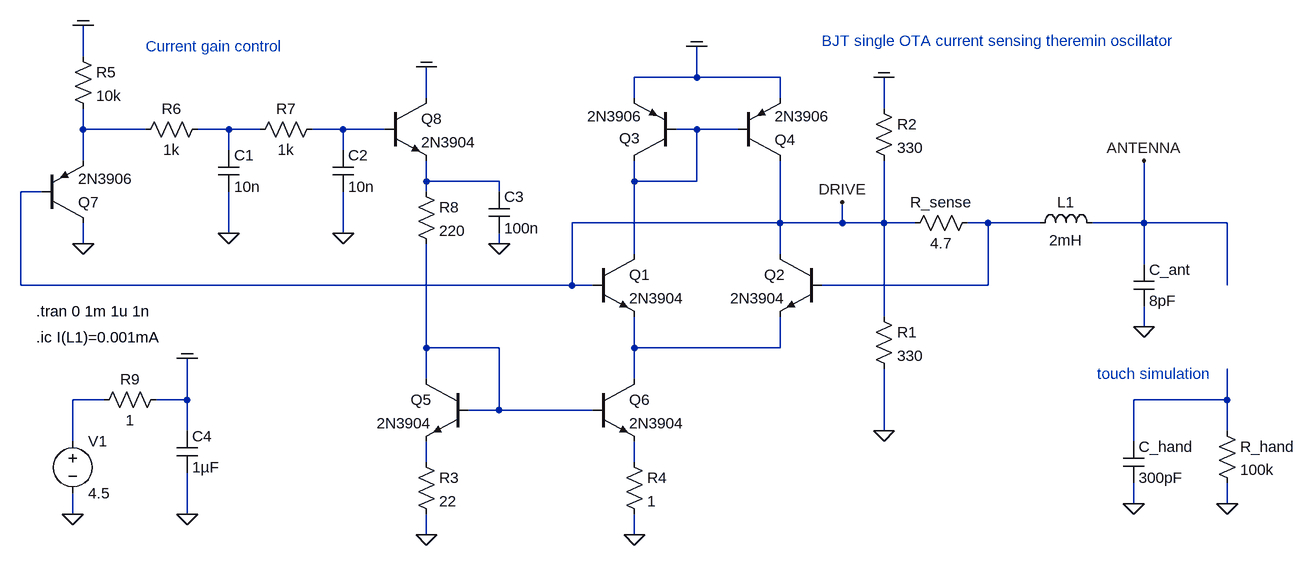
[diagram p0: schematic bjt_current_sensing_oscillator_ota_v4.asc]
bjt_current_sensing_oscillator_ota_v4.asc, the LTspice schematic file:
Version 4
SHEET 1 4500 2052
WIRE -32 0 -32 -48
WIRE 912 32 912 -16
WIRE 912 32 816 32
WIRE 1040 32 912 32
WIRE 496 64 496 16
WIRE 816 64 816 32
WIRE 1040 64 1040 32
WIRE 1200 80 1200 32
WIRE -32 112 -32 80
WIRE 64 112 -32 112
WIRE 192 112 144 112
WIRE 240 112 192 112
WIRE 368 112 320 112
WIRE 432 112 368 112
WIRE 912 112 880 112
WIRE 976 112 912 112
WIRE 192 144 192 112
WIRE 368 144 368 112
WIRE -32 160 -32 112
WIRE 496 192 496 160
WIRE 608 192 496 192
WIRE 816 192 816 160
WIRE 912 192 912 112
WIRE 912 192 816 192
WIRE -96 208 -128 208
WIRE 496 208 496 192
WIRE 608 208 608 192
WIRE 1040 256 1040 160
WIRE 1040 256 720 256
WIRE 1136 256 1136 224
WIRE 1136 256 1040 256
WIRE 1200 256 1200 160
WIRE 1200 256 1136 256
WIRE 1248 256 1200 256
WIRE 1360 256 1328 256
WIRE 1440 256 1360 256
WIRE 1600 256 1600 160
WIRE 1600 256 1520 256
WIRE 1728 256 1600 256
WIRE 192 272 192 208
WIRE 368 272 368 208
WIRE -32 288 -32 256
WIRE 608 288 608 272
WIRE 816 304 816 192
WIRE 1040 304 1040 256
WIRE 1600 320 1600 256
WIRE -128 352 -128 208
WIRE 720 352 720 256
WIRE 720 352 -128 352
WIRE 752 352 720 352
WIRE 1360 352 1360 256
WIRE 1360 352 1104 352
WIRE 1728 352 1728 256
WIRE 1200 400 1200 256
WIRE 1600 416 1600 384
WIRE 496 448 496 288
WIRE 608 448 496 448
WIRE 816 448 816 400
WIRE 1040 448 1040 400
WIRE 1040 448 816 448
WIRE 496 496 496 448
WIRE 816 496 816 448
WIRE 0 528 -48 528
WIRE 128 528 128 464
WIRE 128 528 80 528
WIRE 1728 528 1728 480
WIRE 1728 528 1584 528
WIRE 608 544 608 448
WIRE 608 544 560 544
WIRE 752 544 608 544
WIRE 128 576 128 528
WIRE 1200 576 1200 480
WIRE 1728 576 1728 528
WIRE -48 592 -48 528
WIRE 1584 592 1584 528
WIRE 496 624 496 592
WIRE 816 624 816 592
WIRE 1584 688 1584 656
WIRE 1728 688 1728 656
WIRE -48 704 -48 672
WIRE 128 704 128 640
WIRE 496 736 496 704
WIRE 816 736 816 704
FLAG 1600 416 0
FLAG 1600 160 ANTENNA
FLAG 1200 576 0
FLAG -48 704 0
FLAG 128 464 COM
FLAG 912 -16 COM
FLAG 192 272 0
FLAG 368 272 0
FLAG -32 -48 COM
FLAG -32 288 0
FLAG 496 16 COM
FLAG 496 736 0
FLAG 816 736 0
FLAG 608 288 0
FLAG 1584 688 0
FLAG 1728 688 0
FLAG 1200 32 COM
FLAG 1136 224 DRIVE
FLAG 128 704 0
SYMBOL npn 1104 304 M0
SYMATTR InstName Q2
SYMATTR Value 2N3904
SYMBOL npn 752 304 R0
SYMATTR InstName Q1
SYMATTR Value 2N3904
SYMBOL pnp 976 160 M180
SYMATTR InstName Q4
SYMATTR Value 2N3906
SYMBOL pnp 880 160 R180
WINDOW 0 55 34 Left 2
WINDOW 3 52 68 Left 2
SYMATTR InstName Q3
SYMATTR Value 2N3906
SYMBOL ind 1424 272 R270
WINDOW 0 32 56 VTop 2
WINDOW 3 5 56 VBottom 2
SYMATTR InstName L1
SYMATTR Value 2mH
SYMATTR SpiceLine Ipk=100m Rser=20 Rpar=10Meg Cpar=1pF
SYMBOL cap 1584 320 R0
SYMATTR InstName C_ant
SYMATTR Value 8pF
SYMBOL res 1344 240 R90
WINDOW 0 0 56 VBottom 2
WINDOW 3 32 56 VTop 2
SYMATTR InstName R_sense
SYMATTR Value 4.7
SYMBOL res 1184 384 R0
WINDOW 0 36 40 Left 2
WINDOW 3 36 76 Left 2
SYMATTR InstName R1
SYMATTR Value 330
SYMBOL voltage -48 576 R0
WINDOW 123 0 0 Left 0
WINDOW 39 0 0 Left 0
SYMATTR InstName V1
SYMATTR Value 4.5
SYMBOL cap 176 144 R0
SYMATTR InstName C1
SYMATTR Value 10n
SYMBOL res 160 96 R90
WINDOW 0 0 56 VBottom 2
WINDOW 3 32 56 VTop 2
SYMATTR InstName R6
SYMATTR Value 1k
SYMBOL cap 352 144 R0
SYMATTR InstName C2
SYMATTR Value 10n
SYMBOL res 336 96 R90
WINDOW 0 0 56 VBottom 2
WINDOW 3 32 56 VTop 2
SYMATTR InstName R7
SYMATTR Value 1k
SYMBOL pnp -96 256 M180
SYMATTR InstName Q7
SYMATTR Value 2N3906
SYMBOL res -48 -16 R0
WINDOW 0 36 40 Left 2
WINDOW 3 36 76 Left 2
SYMATTR InstName R5
SYMATTR Value 10k
SYMBOL npn 432 64 R0
SYMATTR InstName Q8
SYMATTR Value 2N3904
SYMBOL npn 560 496 M0
SYMATTR InstName Q5
SYMATTR Value 2N3904
SYMBOL res 480 608 R0
WINDOW 0 36 40 Left 2
WINDOW 3 36 76 Left 2
SYMATTR InstName R3
SYMATTR Value 22
SYMBOL npn 752 496 R0
SYMATTR InstName Q6
SYMATTR Value 2N3904
SYMBOL res 800 608 R0
WINDOW 0 36 40 Left 2
WINDOW 3 36 76 Left 2
SYMATTR InstName R4
SYMATTR Value 1
SYMBOL res 480 192 R0
WINDOW 0 36 40 Left 2
WINDOW 3 36 76 Left 2
SYMATTR InstName R8
SYMATTR Value 220
SYMBOL cap 592 208 R0
SYMATTR InstName C3
SYMATTR Value 100n
SYMBOL cap 1568 592 R0
SYMATTR InstName C_hand
SYMATTR Value 300pF
SYMBOL res 1712 560 R0
WINDOW 0 36 40 Left 2
WINDOW 3 36 76 Left 2
SYMATTR InstName R_hand
SYMATTR Value 100k
SYMBOL res 1184 64 R0
WINDOW 0 36 40 Left 2
WINDOW 3 36 76 Left 2
SYMATTR InstName R2
SYMATTR Value 330
SYMBOL cap 112 576 R0
SYMATTR InstName C4
SYMATTR Value 1µF
SYMBOL res 96 512 R90
WINDOW 0 0 56 VBottom 2
WINDOW 3 32 56 VTop 2
SYMATTR InstName R9
SYMATTR Value 1
TEXT -104 392 Left 2 !.tran 0 1m 1u 1n
TEXT -104 432 Left 2 !.ic I(L1)=0.001mA
TEXT 1104 -24 Left 2 ;BJT single OTA current sensing theremin oscillator
TEXT 64 -16 Left 2 ;Current gain control
TEXT 1528 488 Left 2 ;touch simulation

The netlist it stands for:
* bjt_current_sensing_oscillator_ota_v4.asc
Q2 DRIVE N006 N008 0 2N3904
Q1 N004 DRIVE N008 0 2N3904
Q4 DRIVE N004 COM 0 2N3906
Q3 N004 N004 COM 0 2N3906
L1 N006 ANTENNA 2mH Ipk=100m Rser=20 Rpar=10Meg Cpar=1pF
C_ant ANTENNA 0 8pF
R_sense N006 DRIVE 4.7
R1 DRIVE 0 330
V1 N009 0 4.5
C1 N002 0 10n
R6 N002 N001 1k
C2 N003 0 10n
R7 N003 N002 1k
Q7 0 DRIVE N001 0 2N3906
R5 COM N001 10k
Q8 COM N003 N005 0 2N3904
Q5 N007 N007 N011 0 2N3904
R3 N011 0 22
Q6 N008 N007 N012 0 2N3904
R4 N012 0 1
R8 N005 N007 220
C3 N005 0 100n
C_hand N010 0 300pF
R_hand N010 0 100k
R2 COM DRIVE 330
C4 COM 0 1µF
R9 COM N009 1
.model NPN NPN
.model PNP PNP
.lib standard.bjt
.tran 0 1m 1u 1n
.ic I(L1)=0.001mA
* BJT single OTA current sensing theremin oscillator
* Current gain control
* touch simulation
.backanno
.end